# EAGLE design REPORT_flussimetro (EAGLE 9.6.2)
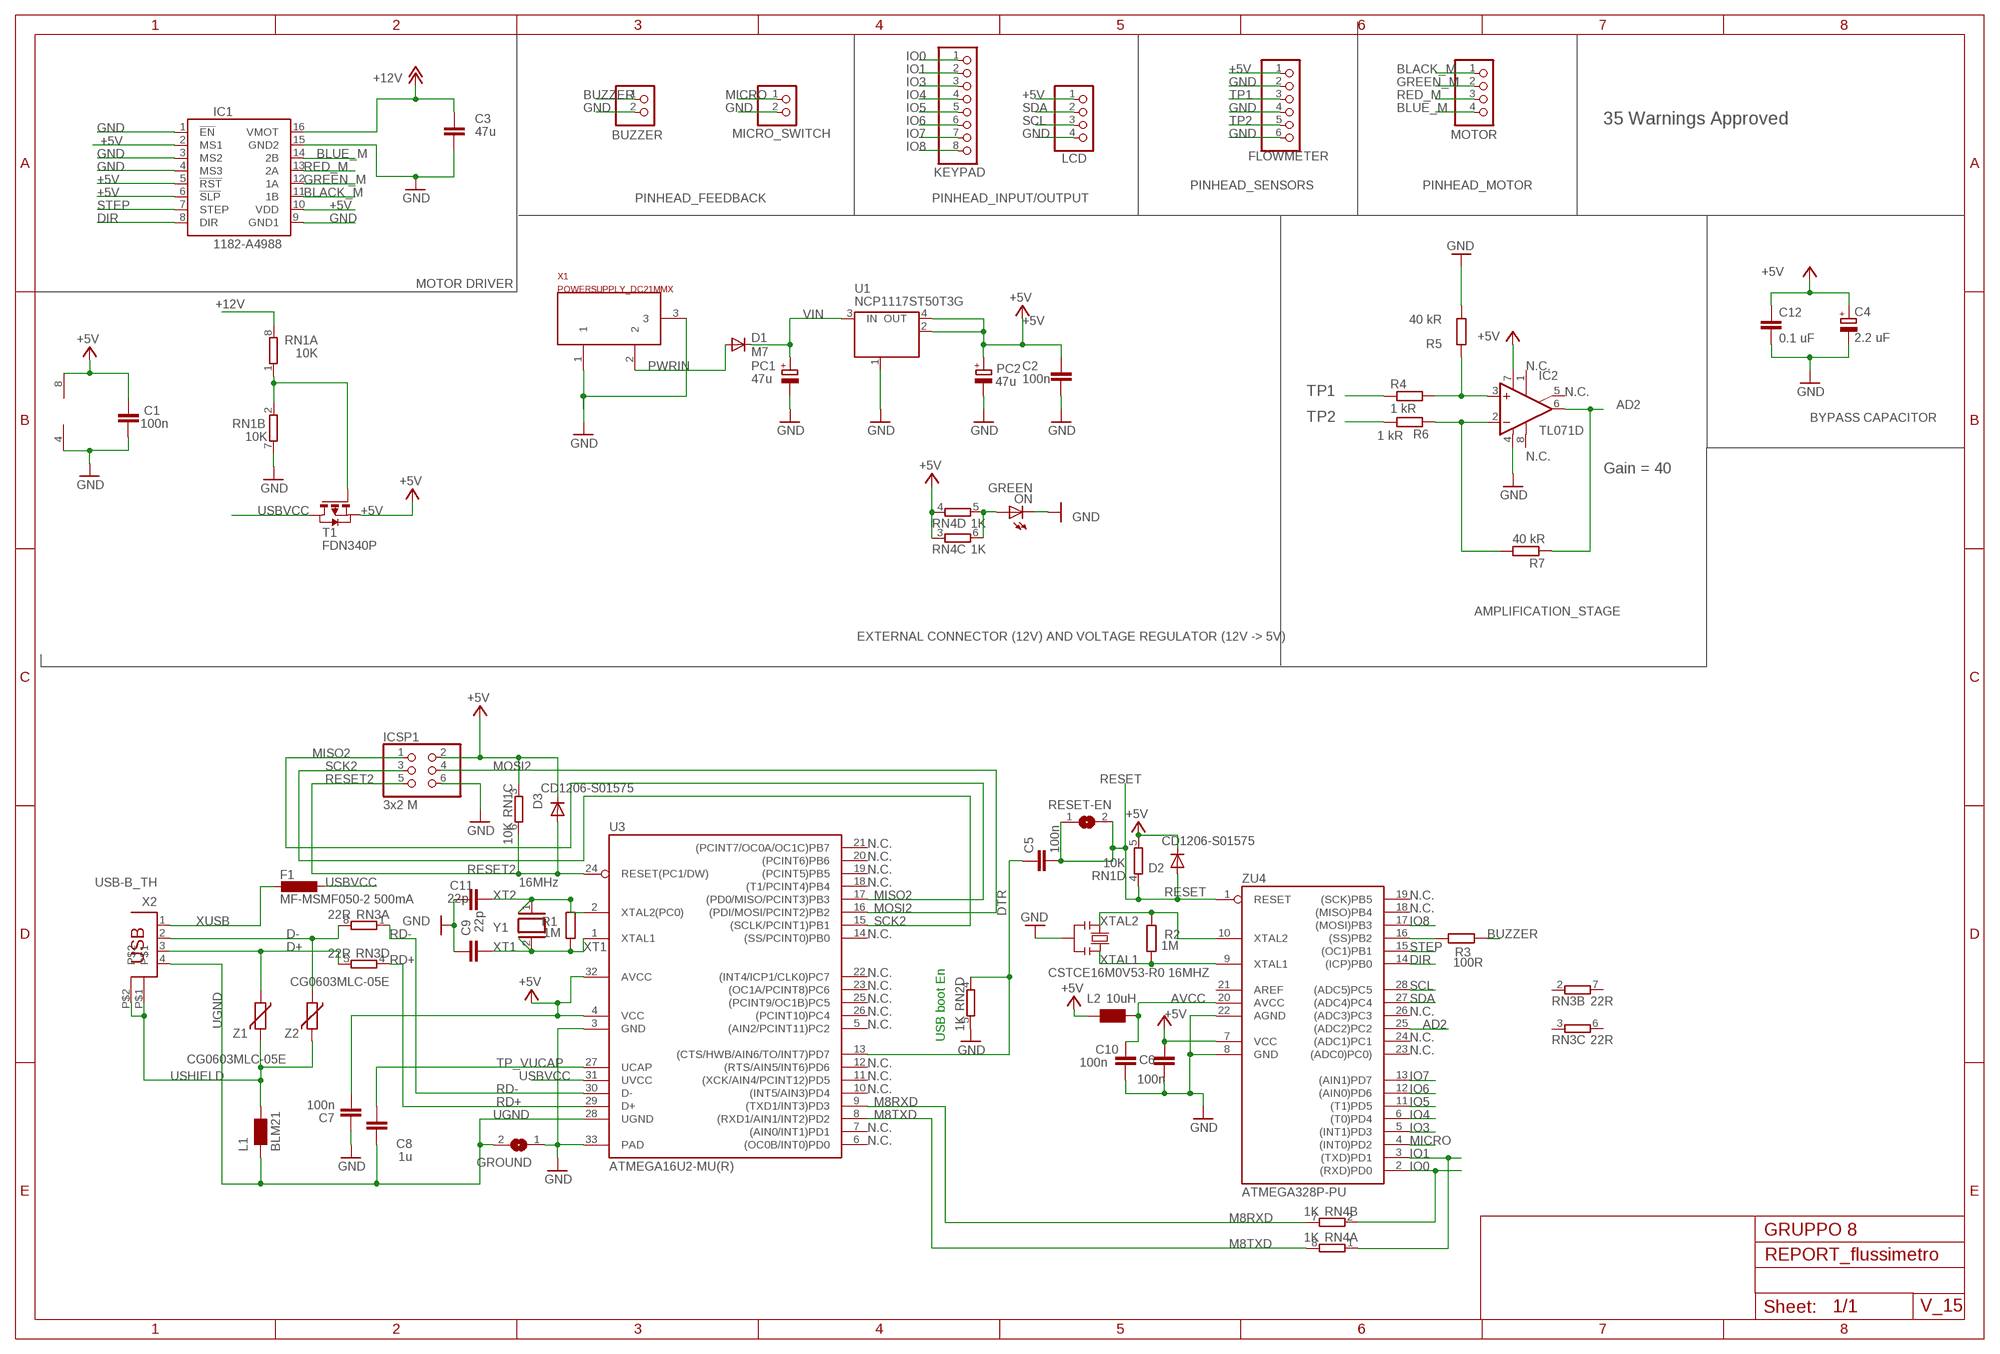
[diagram p0: schematic, sheet 1]

## Parts
BUZZER  PINHD-1X2  [1X02]
C1  100n  C-EU0603-RND  [C0603-ROUND]
C2  100n  C-EU0603-RND  [C0603-ROUND]
C3  47u  C-EUC0603  [C0603]
C4  2.2 uF  CPOL-EUA/3216-18R  [A/3216-18R]
C5  100n  C-EU0603-RND  [C0603-ROUND]
C6  100n  C-EU0603-RND  [C0603-ROUND]
C7  100n  C-EU0603-RND  [C0603-ROUND]
C8  1u  C-EU0603-RND  [C0603-ROUND]
C9  22p  C-EU0603-RND  [C0603-ROUND]
C10  100n  C-EU0603-RND  [C0603-ROUND]
C11  22p  C-EU0603-RND  [C0603-ROUND]
C12  0.1 uF  C-EUC0603  [C0603]
D1  M7  DIODE-SMB  [SMB]
D2  CD1206-S01575  DIODE-MINIMELF  [MINIMELF]
D3  CD1206-S01575  DIODE-MINIMELF  [MINIMELF]
F1  MF-MSMF050-2 500mA  L-EUL1812  [L1812]
FLOWMETER  PINHD-1X6  [1X06]
GROUND  SJ  [SJ]
IC1  1182-A4988  [A4988]
IC2  TL071D  [SO08]
ICSP1  3x2 M  PINHD-2X3  [2X03]
KEYPAD  PINHD-1X8  [1X08]
L1  BLM21  WE-CBF_0805  [0805]
L2  10uH  0715_CV201210-100K  [0805]
LCD  PINHD-1X4  [1X04]
MICRO_SWITCH  PINHD-1X2  [1X02]
MOTOR  PINHD-1X4  [1X04]
ON  GREEN  LEDCHIP-LED0805  [CHIP-LED0805]
PC1  47u  CPOL-EUD  [PANASONIC_D]
PC2  47u  CPOL-EUD  [PANASONIC_D]
R1  1M  R-EU_R0603  [R0603-ROUND]
R2  1M  R-EU_R0603  [R0603-ROUND]
R3  100R  R-EU_R0603  [R0603]
R4  1 kR  R-EU_R0603  [R0603]
R5  40 kR  R-EU_R0603  [R0603]
R6  1 kR  R-EU_R0603  [R0603]
R7  40 kR  R-EU_R0603  [R0603]
RESET-EN  SJ  [SJ]
RN1  10K  4R-NCAY16  [CAY16]
RN2  1K  4R-NCAY16  [CAY16]
RN3  22R  4R-NCAY16  [CAY16]
RN4  1K  4R-NCAY16  [CAY16]
T1  FDN340P  PMOSSOT23  [SOT-23]
U1  NCP1117ST50T3G  MC33269ST-3.3T3  [SOT223]
U3  ATMEGA16U2-MU(R)  ATMEGA16U2-MU  [MLF32]
U5  LMV358IDGKR  LMV358MMX  [MSOP08]
X1  POWERSUPPLY_DC21MMX  [POWERSUPPLY_DC-21MM]
X2  USB-B_TH  PN61729  [PN61729]
Y1  16MHz  XTAL/S  [QS]
Y2  CSTCE16M0V53-R0 16MHZ  RESONATORMU  [RESONATOR]
Z1  CG0603MLC-05E  VARISTORCN0603  [CT/CN0603]
Z2  CG0603MLC-05E  VARISTORCN0603  [CT/CN0603]
ZU4  ATMEGA328P-PU  [DIL28-3]

## Nets
+5V [usbvcc]: C1.2 C2.2 C4.+ C6.2 C7.1 C12.1 D2.C D3.C FLOWMETER.1 IC1.2(MS1) IC1.5(!RST) IC1.6(!SLP) IC1.10(VDD) IC2.7(V+) ICSP1.2 L2.1 LCD.1 PC2.+ RN1.1 RN1.2 RN1.3 RN1.5 RN4.3 RN4.4 T1.2(S) T1.3(G) U1.2(OUT) U1.4(OUT) U3.4(VCC) U3.32(AVCC) U5.8(P:V+) ZU4.7(VCC)
+12V: C3.1 IC1.16(VMOT) RN1.8
AD2: IC2.6(OUT) R7.1 ZU4.25((ADC2)PC2)
AVCC: C10.2 L2.2 ZU4.20(AVCC)
BLACK_M: IC1.11(1B) MOTOR.1
BLUE_M: IC1.14(2B) MOTOR.4
BUZZER: BUZZER.1 R3.2
D+: RN3.5 X2.3 Z1.1
D-: RN3.8 X2.2 Z2.1
DIR: IC1.8(DIR) ZU4.14((ICP)PB0)
DTR: C5.1 RN2.4 U3.13((CTS/HWB/AIN6/TO/INT7)PD7)
GND [gnd]: BUZZER.2 C1.1 C2.1 C3.2 C4.- C6.1 C7.2 C9.2 C10.1 C11.2 C12.2 FLOWMETER.2 FLOWMETER.4 FLOWMETER.6 GROUND.1 IC1.1(!EN) IC1.3(MS2) IC1.4(MS3) IC1.9(GND1) IC1.15(GND2) IC2.4(V-) ICSP1.6 LCD.4 MICRO_SWITCH.2 ON.C PC1.- PC2.- R5.2 RN1.7 RN2.5 U1.1(GND/ADJ) U3.3(GND) U3.33(PAD) U5.4(P:V-) X1.1 X1.3 Y2.2 ZU4.8(GND) ZU4.22(AGND)
GREEN_M: IC1.12(1A) MOTOR.2
IO0: KEYPAD.1 RN4.2 ZU4.2((RXD)PD0)
IO1: KEYPAD.2 RN4.1 ZU4.3((TXD)PD1)
IO3: KEYPAD.3 ZU4.5((INT1)PD3)
IO4: KEYPAD.4 ZU4.6((T0)PD4)
IO5: KEYPAD.5 ZU4.11((T1)PD5)
IO6: KEYPAD.6 ZU4.12((AIN0)PD6)
IO7: KEYPAD.7 ZU4.13((AIN1)PD7)
IO8: KEYPAD.8 ZU4.17((MOSI)PB3)
IO16: R3.1 ZU4.16((SS)PB2)
M8RXD: RN4.7 U3.9((TXD1/INT3)PD3)
M8TXD: RN4.8 U3.8((RXD1/AIN1/INT2)PD2)
MICRO: MICRO_SWITCH.1 ZU4.4((INT0)PD2)
MISO2: ICSP1.1 U3.17((PD0/MISO/PCINT3)PB3)
MOSI2: ICSP1.4 U3.16((PDI/MOSI/PCINT2)PB2)
N$1: IC2.2(-IN) R6.1 R7.2
N$2: IC2.3(+IN) R4.2 R5.1
N$3: ON.A RN4.5 RN4.6
PWRIN [power]: D1.A X1.2
RD+: RN3.4 U3.29(D+)
RD-: RN3.1 U3.30(D-)
RED_M: IC1.13(2A) MOTOR.3
RESET: C5.2 D2.A RESET-EN.1 RESET-EN.2 RN1.4 ZU4.1(RESET)
RESET2: D3.A ICSP1.5 RN1.6 U3.24(RESET(PC1/DW))
SCK2: ICSP1.3 U3.15((SCLK/PCINT1)PB1)
SCL: LCD.3 ZU4.28((ADC5)PC5)
SDA: LCD.2 ZU4.27((ADC4)PC4)
STEP: IC1.7(STEP) ZU4.15((OC1)PB1)
TP1: FLOWMETER.3 R4.1
TP2: FLOWMETER.5 R6.2
TP_VUCAP: C8.1 U3.27(UCAP)
UGND [gnd]: C8.2 GROUND.2 L1.1 U3.28(UGND) X2.4
USBVCC [usbvcc]: F1.1 T1.1(D) U3.31(UVCC)
USHIELD [gnd]: L1.2 X2.P$1 X2.P$2 Z1.2 Z2.2
VIN [power]: D1.C PC1.+ U1.3(IN)
XT1: C9.1 R1.1 U3.1(XTAL1) Y1.2
XT2: C11.1 R1.2 U3.2(XTAL2(PC0)) Y1.1
XTAL1: R2.1 Y2.3 ZU4.9(XTAL1)
XTAL2: R2.2 Y2.1 ZU4.10(XTAL2)
XUSB [usbvcc]: F1.2 X2.1
Unconnected: IC2.1(ON1) IC2.5(ON2) IC2.8(OPT) RN2.1 RN2.2 RN2.3 RN2.6 RN2.7 RN2.8 RN3.2 RN3.3 RN3.6 RN3.7 U3.5((AIN2/PCINT11)PC2) U3.6((OC0B/INT0)PD0) U3.7((AIN0/INT1)PD1) U3.10((INT5/AIN3)PD4) U3.11((XCK/AIN4/PCINT12)PD5) U3.12((RTS/AIN5/INT6)PD6) U3.14((SS/PCINT0)PB0) U3.18((T1/PCINT4)PB4) U3.19((PCINT5)PB5) U3.20((PCINT6)PB6) U3.21((PCINT7/OC0A/OC1C)PB7) U3.22((INT4/ICP1/CLK0)PC7) U3.23((OC1A/PCINT8)PC6) U3.25((PCINT9/OC1B)PC5) U3.26((PCINT10)PC4) U5.1(A:OUT) U5.2(A:-IN) U5.3(A:+IN) U5.5(B:+IN) U5.6(B:-IN) U5.7(B:OUT) ZU4.18((MISO)PB4) ZU4.19((SCK)PB5) ZU4.21(AREF) ZU4.23((ADC0)PC0)) ZU4.24((ADC1)PC1) ZU4.26((ADC3)PC3)

## Notes on the sheet
- 35 Warnings Approved
- PINHEAD_SENSORS | PINHEAD_MOTOR
- PINHEAD_FEEDBACK | PINHEAD_INPUT/OUTPUT
- MOTOR DRIVER
- N.C.
- N.C.
- BYPASS CAPACITOR
- N.C.
- Gain = 40
- AMPLIFICATION_STAGE
- EXTERNAL CONNECTOR (12V) AND VOLTAGE REGULATOR (12V -> 5V)
- N.C.
- N.C.
- N.C.
- N.C.
- N.C.
- N.C.
- N.C.
- N.C.
- N.C.
- N.C.
- N.C. | N.C.
- N.C.
- USB boot En | N.C.
- N.C.
- N.C.
- N.C.
- N.C.
- N.C.
- N.C.
- GRUPPO 8
- V_15

## Library data of the parts
BUZZER MICRO_SWITCH = pinhead:PINHD-1X2: PIN HEADER; MF: AMP - TE CONNECTIVITY; MPN: 826926-2; OC_FARNELL: 1248140
C1 C2 C5-C7 C10 = SmartPrj:C-EU: CAPACITOR, European symbol; MF: GEDORE; MPN: 4550-10; OC_FARNELL: 4726741
C3 = rcl:C-EU: CAPACITOR, European symbol; MF: MURATA; MPN: GRM188R60J476ME15D; OC_FARNELL: 3582851; SPICEPREFIX: C
C4 = rcl:CPOL-EU: POLARIZED CAPACITOR, European symbol; MF: KYOCERA AVX; MPN: TAJA225K016RNJ; OC_FARNELL: 197233; SPICEPREFIX: C
C8 = SmartPrj:C-EU: CAPACITOR, European symbol; MF: TDK; MPN: C1608X5R1C105K080AA; OC_FARNELL: 2211167
C9 C11 = SmartPrj:C-EU: CAPACITOR, European symbol; MF: KYOCERA AVX; MPN: 06035A220FAT2A; OC_FARNELL: 2332610
C12 = rcl:C-EU: CAPACITOR, European symbol; MF: KYOCERA AVX; MPN: 0603YC104KAT2A; OC_FARNELL: 1327679; SPICEPREFIX: C
D1 = diode:DIODE-: DIODE; MF: DIODES INC.; MPN: S1M-13-F; OC_FARNELL: 1773482
D2 D3 = diode:DIODE-: DIODE; MF: BOURNS; MPN: CD1206-S01575; OC_FARNELL: 2211947
F1 = rcl:L-EU: INDUCTOR, European symbol; MF: BOURNS; MPN: MF-MSMF050-2; OC_FARNELL: 9350314
FLOWMETER = pinhead:PINHD-1X6: PIN HEADER; MF: MULTICOMP PRO; MPN: 2211S-06G; OC_FARNELL: 1593415
GROUND RESET-EN = jumper:SJ: SMD solder JUMPER; OC_FARNELL: unknown
IC1 = DRIVER MOTORE:1182-A4988: A4988 Stepper Motor Driver Carrier #1182 A4988 Stepper Motor Driver Carrier <https://www.pololu.com/product/1182> in Japan, Suzaku Lab. Ltd. <https://suzakugiken.jp/> #1182 A4988ステッピングモータドライバ <https://szc.jp/po1182>; OC_FARNELL: unknown
IC2 = linear:TL071: OP AMP; MF: ANALOG DEVICES; MPN: LT1211CS8#TRPBF; OC_FARNELL: 4020590
ICSP1 = SmartPrj:PINHD-2X3: PIN HEADER; MF: MOLEX; MPN: 87758-0616; OC_FARNELL: 7472323
KEYPAD = pinhead:PINHD-1X8: PIN HEADER; MF: MULTICOMP PRO; MPN: 2211S-08G; OC_FARNELL: 1593416
L1 = wuerth-elektronik:WE-CBF: SMD EMI Suppression Ferrite Beads - excellent anti-EMI properties - low DCR - impedances till 3000 ohms - rated current up to 6 A; MF: MURATA; MPN: BLM21SP471BH1D; OC_FARNELL: 3227834
L2 = Induttanze:0715_CV201210-100K: 10uH 0805; CASE: 0805; MF: BOURNS; MONTHLY_USAGE: _____; MPN: CV201210-100K; OC_FARNELL: 2333632; PART_NUMBER: CV201210-100K; PRICE: _____; SUPPLIER: _____; TYPE: Induttanze
LCD MOTOR = pinhead:PINHD-1X4: PIN HEADER; MF: AMP - TE CONNECTIVITY; MPN: 826926-4; OC_FARNELL: 1248142
ON = led:LED: LED OSRAM: - CHIPLED LG R971, LG N971, LY N971, LG Q971, LY Q971, LO R971, LY R971 LH N974, LH R974 LS Q976, LO Q976, LY Q976 LO Q996 - Hyper CHIPLED LW Q18S LB Q993, LB Q99A, LB R99A - SideLED LS A670, LO A670, LY A670, LG A670, LP A670 LB A673, LV A673, LT A673, LW A673 LH A674 LY A675 LS A676, LA A676, LO A676, LY A676, LW A676 LS A679, LY A679, LG A679 - Hyper Micro SIDELED® LS Y876, LA Y876, LO Y876, LY Y876 LT Y87S - SmartLED LW L88C, LW L88S LB L89C, LB L89S, LG L890 LS L89K, LO L89K, LY L89K LS L896, LA L896, LO L896, LY L896 - TOPLED LS T670, LO T670, LY T670, LG T670, LP T670 LSG T670, LSP T670, LSY T670, LOP T670, LYG T670 LG T671, LOG T671, LSG T671 LB T673, LV T673, LT T673, LW T673 LH T674 LS T676, LA T676, LO T676, LY T676, LB T676, LH T676, LSB T676, LW T676 LB T67C, LV T67C, LT T67C, LS T67K, LO T67K, LY T67K, LW E67C LS E67B, LA E67B, LO E67B, LY E67B, LB E67C, LV E67C, LT E67C LW T67C LS T679, LY T679, LG T679 LS T770, LO T770, LY T770, LG T770, LP T770 LB T773, LV T773, LT T773, LW T773 LH T774 LS E675, LA E675, LY E675, LS T675 LS T776, LA T776, LO T776, LY T776, LB T776 LHGB T686 LT T68C, LB T68C - Hyper Mini TOPLED® LB M676 - Mini TOPLED Santana® LG M470 LS M47K, LO M47K, LY M47K Source: http://www.osram.convergy.de LUXEON: - LUMILED® LXK2-PW12-R00, LXK2-PW12-S00, LXK2-PW14-U00, LXK2-PW14-V00 LXK2-PM12-R00, LXK2-PM12-S00, LXK2-PM14-U00 LXK2-PE12-Q00, LXK2-PE12-R00, LXK2-PE12-S00, LXK2-PE14-T00, LXK2-PE14-U00 LXK2-PB12-K00, LXK2-PB12-L00, LXK2-PB12-M00, LXK2-PB14-N00, LXK2-PB14-P00, LXK2-PB14-Q00 LXK2-PR12-L00, LXK2-PR12-M00, LXK2-PR14-Q00, LXK2-PR14-R00 LXK2-PD12-Q00, LXK2-PD12-R00, LXK2-PD12-S00 LXK2-PH12-R00, LXK2-PH12-S00 LXK2-PL12-P00, LXK2-PL12-Q00, LXK2-PL12-R00 Source: www.luxeon.com KINGBRIGHT: KA-3528ASYC Source: www.kingbright.com; MF: KINGBRIGHT; MPN: KP-1608SGC; OC_FARNELL: 8529833
PC1 PC2 = rcl:CPOL-EU: POLARIZED CAPACITOR, European symbol; MF: PANASONIC; MPN: EEE1EA470WP; OC_FARNELL: 2805691
R1 R2 = SmartPrj:R-EU_: RESISTOR, European symbol; MF: TE CONNECTIVITY; MPN: CRGH0603J1M0; OC_FARNELL: 2331766
R3 = rcl:R-EU_: RESISTOR, European symbol; MF: PANASONIC; MPN: ERJPA3F1000V; OC_FARNELL: 2335829; SPICEPREFIX: R
R4 R6 = rcl:R-EU_: RESISTOR, European symbol; MF: NEOHM - TE CONNECTIVITY; MPN: CPF0603B1K0E1; OC_FARNELL: 1697375; SPICEPREFIX: R
R5 R7 = rcl:R-EU_: RESISTOR, European symbol; MF: YAGEO; MPN: AT0603BRD0740KL; OC_FARNELL: 3952492; SPICEPREFIX: R
RN1 = resistor-dil:4R-N: Array Chip Resistor Source: RS Component / Phycomp; MF: BOURNS; MPN: CAY16-1002F4LF; OC_FARNELL: 1770143
RN2 RN4 = resistor-dil:4R-N: Array Chip Resistor Source: RS Component / Phycomp; MF: BOURNS; MPN: CAY16-102J4LF; OC_FARNELL: 1770133
RN3 = resistor-dil:4R-N: Array Chip Resistor Source: RS Component / Phycomp; MF: BOURNS; MPN: CAY16-220J4LF; OC_FARNELL: 1770127
T1 = zetex:PMOSSOT23: MOS FET; MF: ONSEMI; MPN: FDN340P; OC_FARNELL: 9846310
U1 = linear:MC33269ST*: Adjustable Output Low Dropout Voltage Regulator 800 mA Source: http://www.onsemi.com/pub/Collateral/MC33269-D.PDF; MF: ONSEMI; MPN: NCP1117ST50T3G; OC_FARNELL: 2112617
U3 = SmartPrj:ATMEGA16U2-; MF: MICROCHIP; MPN: ATMEGA16U2-MUR; OC_FARNELL: 2695247
U5 = linear:LMV358?*: Dual General Purpose, Low Voltage, Rail-to-Rail Output Operational Amplifiers Source: http://www.national.com/mpf/LM/LMV321.html http://www.national.com/dt/lmv_qual.pdf; MF: STMICROELECTRONICS; MPN: LMV358LIST; OC_FARNELL: 2849869
X1 = SmartPrj:POWERSUPPLY_DC21MM; MF: LUMBERG; MPN: 1613 21; OC_FARNELL: 3583208
X2 = SmartPrj:PN61729: BERG USB connector; MF: MULTICOMP PRO; MPN: SPC4937; OC_FARNELL: 3699894
Y1 = SmartPrj:XTAL/S: CRYSTAL; MF: ECS INC INTERNATIONAL; MPN: ECS-160-20-4X; OC_FARNELL: 4059213RL
Y2 = SmartPrj:RESONATOR; MF: MURATA; MPN: CSTNE16M0V51C000R0; OC_FARNELL: 4129976
Z1 Z2 = varistor:VARISTOR: VARISTOR; MF: BOURNS; MPN: CG0603MLC-05E; OC_FARNELL: 1838966
ZU4 = SmartPrj:ATMEGA328P-: MICROCONTROLLER 4 Kbytes FLASH 128 bytes SRAM 256 bytes EEPROM UART 6-channel 10 bit ADC; MF: MICROCHIP; MPN: ATMEGA328P-PU; OC_FARNELL: 1715487

## Net classes
0 default: width 0.254 mm, clearance 0.254 mm
1 power: width 0.61 mm, drill 0.61 mm, clearance 0.254 mm
2 gnd: width 0.305 mm, drill 0.559 mm, clearance 0.254 mm
3 usbvcc: width 0.508 mm, drill 0.61 mm, clearance 0.254 mm
4 aref: width 0.406 mm, drill 0.61 mm, clearance 0.254 mm

## Board
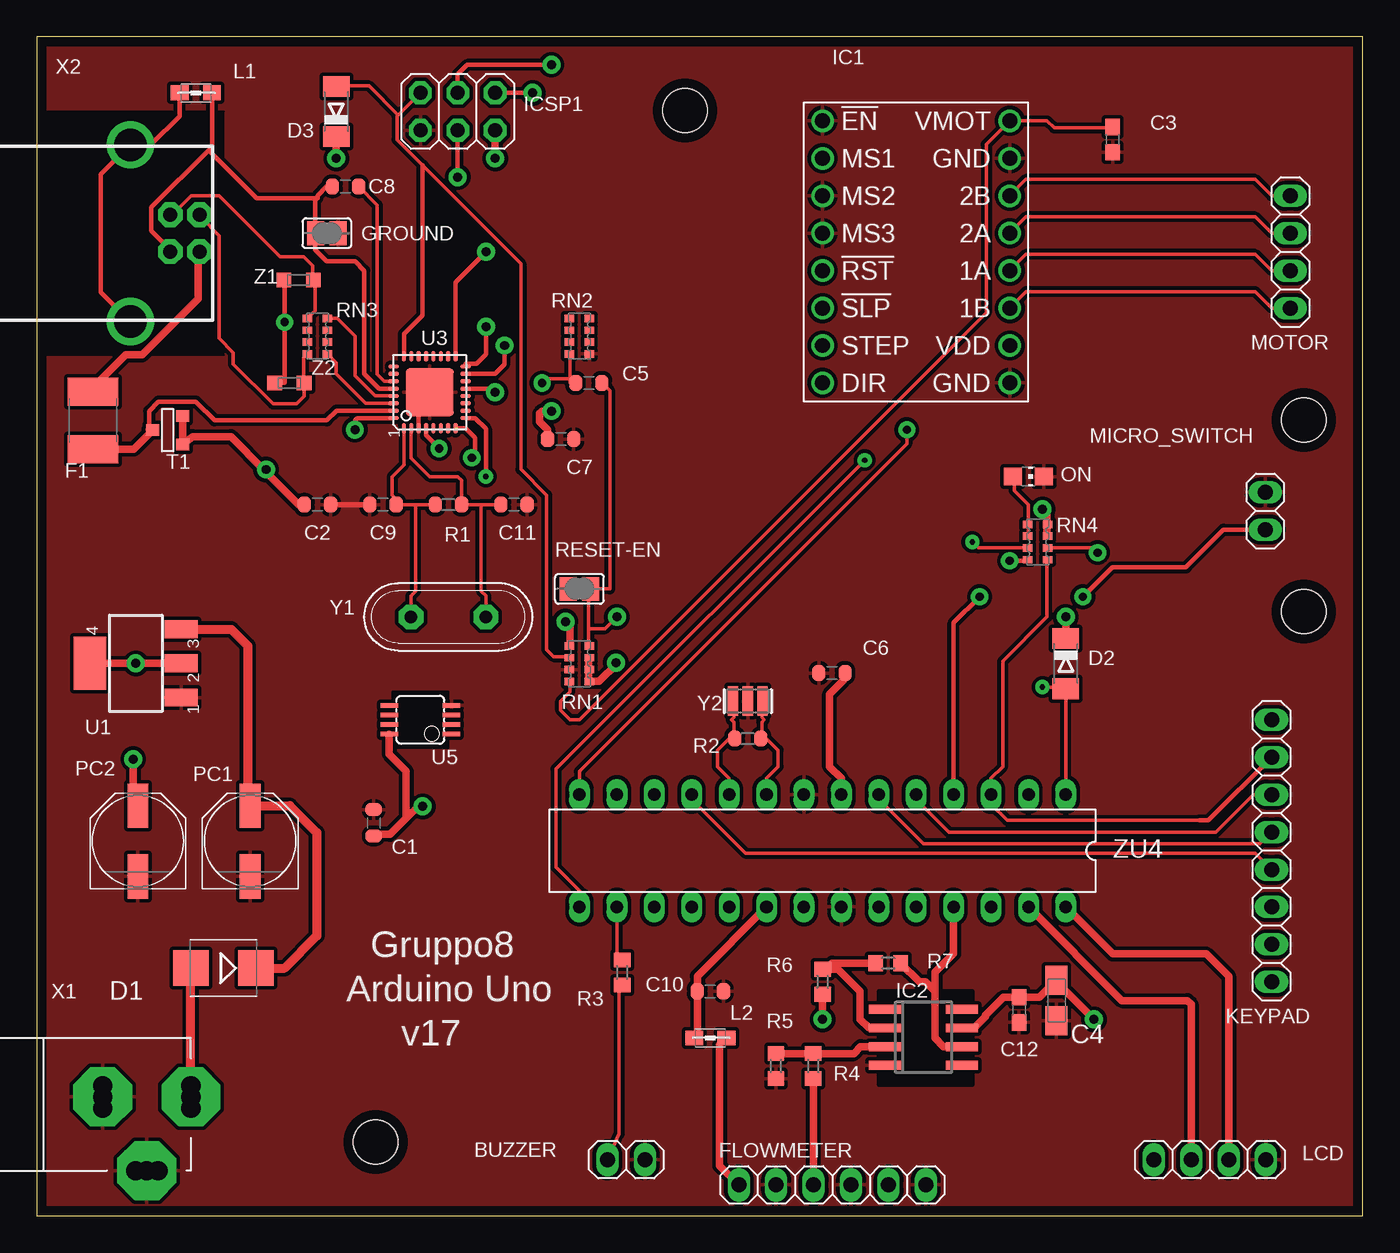
[diagram p1: board, top side]
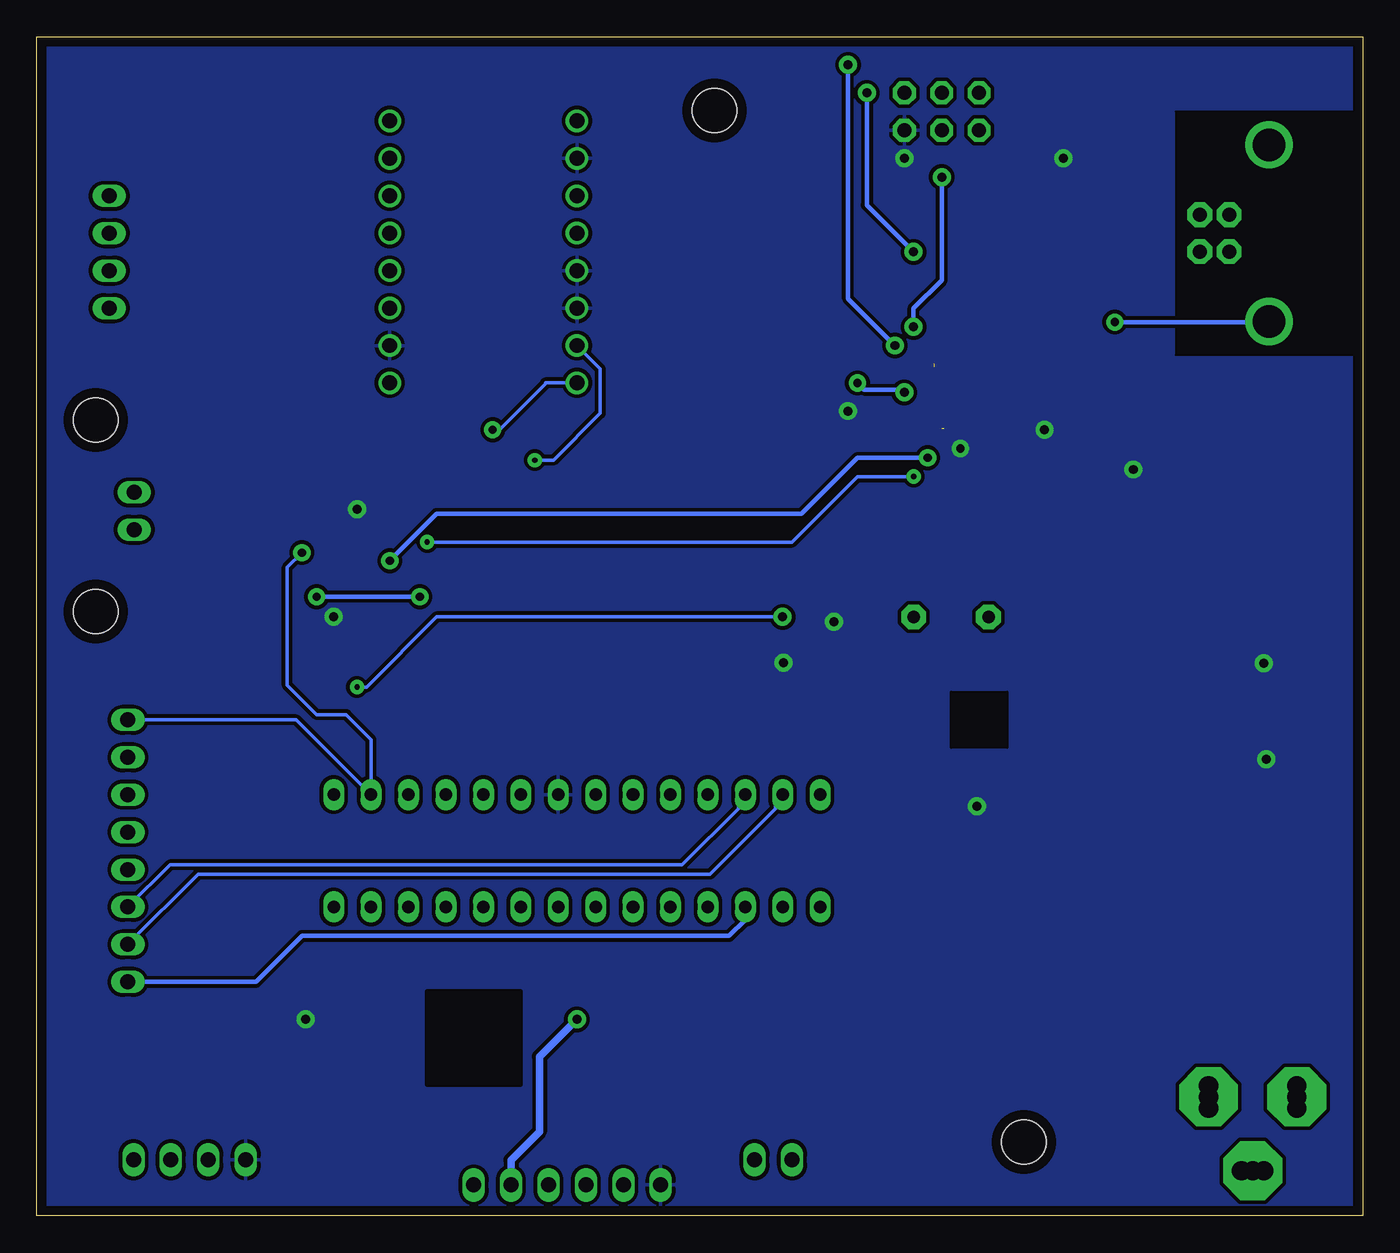
[diagram p2: board, bottom side, seen from below]

Size 90 x 80 mm. Coordinates in mm from the lower left corner, seen from the top.
Outline: 0,80 0,0 90,0 90,80 0,80
Copper layers (1*16): Top 0.035mm / dielectric 1.5mm / Bottom 0.035mm
Design rules "default *": minimum track width 10mil, minimum drill 22mil, track to track 10mil, track to pad 10mil, pad to pad 10mil, via to via 12mil, smd to smd 8mil, copper to edge 26mil, drill to drill 12mil, minimum pad ring 10mil, minimum via ring 12mil, stop-mask expansion 1mil, vias tented up to drill 30mil, thermal gap 10mil
Holes 3 mm at 23,5 44,75 86,54 86,41

### Footprints (pad centres in the part's own frame; a part is rotated, then mirrored left to right if it is on the bottom)
1X02 = drill 1.016 long: 1 -1.27,0; 2 1.27,0
C0603-ROUND = smd 0.898 x 1.1: 1 -0.889,0; 2 0.889,0
C0603 = smd 1.1 x 1: 1 -0.85,0; 2 0.85,0
A/3216-18R = smd 1.95 x 1.5: + 1.375,0; - -1.375,0
SMB = smd 2.4 x 2.4: A 2.2,0; C -2.2,0
MINIMELF = smd 1.4 x 1.8: A 1.7,0; C -1.7,0
L1812 = smd 1.9 x 3.4: 1 -1.95,0; 2 1.95,0
1X06 = drill 1.016 long: 1 -6.35,0; 2 -3.81,0; 3 -1.27,0; 4 1.27,0; 5 3.81,0; 6 6.35,0
SJ = smd 1.168 x 1.6: 1 -0.762,0; 2 0.762,0
A4988 = drill 1.016: 1 -6.35,8.89; 2 -6.35,6.35; 3 -6.35,3.81; 4 -6.35,1.27; 5 -6.35,-1.27; 6 -6.35,-3.81; 7 -6.35,-6.35; 8 -6.35,-8.89; 9 6.35,-8.89; 10 6.35,-6.35; 11 6.35,-3.81; 12 6.35,-1.27; 13 6.35,1.27; 14 6.35,3.81; 15 6.35,6.35; 16 6.35,8.89
SO08 = smd 0.6 x 2.2: 1 -1.905,-2.6; 2 -0.635,-2.6; 3 0.635,-2.6; 4 1.905,-2.6; 5 1.905,2.6; 6 0.635,2.6; 7 -0.635,2.6; 8 -1.905,2.6
2X03 = drill 0.95 pad 1.55 octagon: 1 -2.54,-1.27; 2 -2.54,1.27; 3 0,-1.27; 4 0,1.27; 5 2.54,-1.27; 6 2.54,1.27
1X08 = drill 1.016 long: 1 -8.89,0; 2 -6.35,0; 3 -3.81,0; 4 -1.27,0; 5 1.27,0; 6 3.81,0; 7 6.35,0; 8 8.89,0
0805 = smd 1.2 x 1: 1 -1.1,0; 2 1.1,0
1X04 = drill 1.016 long: 1 -3.81,0; 2 -1.27,0; 3 1.27,0; 4 3.81,0
CHIP-LED0805 = smd 1.2 x 1.2: A 0,-1.05; C 0,1.05
PANASONIC_D = smd 3 x 1.4: + 2.4,0; - -2.4,0
R0603-ROUND = smd 0.898 x 1.1: 1 -0.889,0; 2 0.889,0
R0603 = smd 1 x 1.1: 1 -0.85,0; 2 0.85,0
CAY16 = smd 0.5 x 0.65: 1 -1.2,-0.675; 2 -0.4,-0.675; 3 0.4,-0.675; 4 1.2,-0.675; 5 1.2,0.675; 6 0.4,0.675; 7 -0.4,0.675; 8 -1.2,0.675
SOT-23 = smd 0.787 x 0.889: 1 0.025,-1.016; 2 -0.94,1.016; 3 0.991,1.016
SOT223 = smd 1.219 x 2.235: 1 -2.311,-3.099; 2 0,-3.099; 3 2.311,-3.099 | smd 3.6 x 2.2: 4 0,3.099
MLF32 = smd 0.7 x 0.28: 1 -2.45,1.75; 2 -2.45,1.25; 3 -2.45,0.75; 4 -2.45,0.25; 5 -2.45,-0.25; 6 -2.45,-0.75; 7 -2.45,-1.25; 8 -2.45,-1.75; 17 2.45,-1.75; 18 2.45,-1.25; 19 2.45,-0.75; 20 2.45,-0.25; 21 2.45,0.25; 22 2.45,0.75; 23 2.45,1.25; 24 2.45,1.75 | smd 0.28 x 0.7: 9 -1.75,-2.45; 10 -1.25,-2.45; 11 -0.75,-2.45; 12 -0.25,-2.45; 13 0.25,-2.45; 14 0.75,-2.45; 15 1.25,-2.45; 16 1.75,-2.45; 25 1.75,2.45; 26 1.25,2.45; 27 0.75,2.45; 28 0.25,2.45; 29 -0.25,2.45; 30 -0.75,2.45; 31 -1.25,2.45; 32 -1.75,2.45 | smd 3.254 x 3.254: 33 0,0
MSOP08 = smd 0.3 x 1.2: 1 -0.976,-2.113; 2 -0.326,-2.113; 3 0.324,-2.113; 4 0.974,-2.113; 5 0.974,2.112; 6 0.324,2.112; 7 -0.326,2.112; 8 -0.976,2.112
POWERSUPPLY_DC-21MM = drill 1.3 pad 4 octagon: 1 -5.08,-3.353; 2 -0.076,-6.35; 3 -0.076,-0.356 | drill 1.3: 4 -5.08,-4.115; 5 -5.08,-2.591; 6 -0.838,-0.356; 7 0.686,-0.356; 8 -0.838,-6.35; 9 0.686,-6.35
PN61729 = drill 0.95 pad 1.676 octagon: 1 1.25,4.71; 2 -1.25,4.71; 3 -1.25,2.71; 4 1.25,2.71 | drill 2.2: P$1 -6,0; P$2 6,0
QS = drill 0.85 pad 1.676 octagon: 1 -2.54,0; 2 2.54,0
RESONATOR = smd 0.7 x 2: 1 -1,0; 2 0,0; 3 1,0
CT/CN0603 = smd 1 x 1: 1 -1,0; 2 1,0
DIL28-3 = drill 0.85 pad 1.422 long: 1 -16.51,-3.81; 2 -13.97,-3.81; 3 -11.43,-3.81; 4 -8.89,-3.81; 5 -6.35,-3.81; 6 -3.81,-3.81; 7 -1.27,-3.81; 8 1.27,-3.81; 9 3.81,-3.81; 10 6.35,-3.81; 11 8.89,-3.81; 12 11.43,-3.81; 13 13.97,-3.81; 14 16.51,-3.81; 15 16.51,3.81; 16 13.97,3.81; 17 11.43,3.81; 18 8.89,3.81; 19 6.35,3.81; 20 3.81,3.81; 21 1.27,3.81; 22 -1.27,3.81; 23 -3.81,3.81; 24 -6.35,3.81; 25 -8.89,3.81; 26 -11.43,3.81; 27 -13.97,3.81; 28 -16.51,3.81

### Placement (x,y rotation side)
BUZZER  40.01,3.81 0 top
C1  22.86,26.67 270 top
C2  19.05,48.26 180 top
C3  73.03,73.03 270 top
C4  69.22,14.61 90 top
C5  37.47,56.52 0 top
C6  53.98,36.83 0 top
C7  35.56,52.7 0 top
C8  20.95,69.85 180 top
C9  23.5,48.26 180 top
C10  45.72,15.24 180 top
C11  32.38,48.26 0 top
C12  66.67,13.97 270 top
D1  12.67,16.81 180 top
D2  69.85,37.47 270 top
D3  20.32,74.93 90 top
F1  3.81,53.98 90 top
FLOWMETER  54,2.1 0 top
GROUND  19.68,66.67 180 top
IC1  59.69,65.41 0 top
IC2  60.2,12.11 270 top
ICSP1  28.57,74.93 180 top
KEYPAD  83.82,24.77 270 top
L1  10.79,76.2 180 top
L2  45.72,12.06 180 top
LCD  79.63,3.81 0 top
MICRO_SWITCH  83.39,47.83 90 top
MOTOR  85.09,65.41 90 top
ON  67.31,50.16 270 top
PC1  14.48,25.43 90 top
PC2  6.86,25.43 90 top
R1  27.94,48.26 0 top
R2  48.26,32.38 180 top
R3  39.73,16.51 270 top
R4  52.7,10.16 90 top
R5  50.16,10.16 270 top
R6  53.34,15.88 270 top
R7  57.78,17.14 180 top
RESET-EN  36.83,42.55 0 top
RN1  36.83,37.47 90 top
RN2  36.83,59.69 270 top
RN3  19.05,59.69 90 top
RN4  67.94,45.72 90 top
T1  8.89,53.34 270 top
U1  6.71,37.48 90 top
U3  26.67,55.88 90 top
U5  26.04,33.66 90 top
X1  4.11,8.14 90 top
X2  6.35,66.67 270 top
Y1  27.94,40.64 180 top
Y2  48.26,34.92 0 top
Z1  17.78,63.5 180 top
Z2  17.14,56.52 180 top
ZU4  53.34,24.77 180 top

### Tracks (layer width: path | path; a pad name or v marks a point on that pad's centre or on a via)
+5V  (via drill 0.56, 0.61)
  Top 0.305: U3.4 26.42,52.95 v27.3,52.07 | U3.32 21.75,54.13 21.59,53.98 v21.59,53.34
  Top 0.508: C2.2 17.78,48.26 15.48,50.56 | 15.48,50.56 13.18,52.86 10.57,52.86 T1.3 T1.2 | U1.4 v6.71,37.48 U1.2 | 25.08,26.99 26.04,27.94 v26.19,27.78 | 25.08,26.99 23.97,25.88 22.86,25.88 C1.2 | 25.08,26.99 25.08,30.16 23.92,31.32 U5.8 | RN1.3 37.47,37.78 37.47,37.31 RN1.2 37.47,36.99 37.47,36.35 RN1.1 38.17,36.27 39.37,37.47 v39.3,37.53 | RN4.3 68.58,46.2 68.58,46.83 RN4.4 68.58,47.15 68.58,47.62 v68.26,47.94 | v35.88,40.32 36.2,40.01 36.2,38.73 RN1.5 | v34.92,54.61 34.29,54.61 | 34.29,54.61 | 34.29,54.61 34.13,54.45 34.13,53.88 34.67,53.34 C7.1 | ZU4.7 54.61,29.69 53.82,30.48 53.82,35.4 54.77,36.35 54.77,36.83 C6.2 | v20.32,71.75 D3.C | v69.85,40.64 D2.C | PC2.+ 6.54,28.15 v6.54,30.99 | v15.56,50.64 15.48,50.56 | ICSP1.2 v31.11,71.75 | FLOWMETER.1 46.35,3.39 46.35,11.6 L2.1 | v71.75,13.34 69.22,15.88 C4.+ 68.06,14.82 67.31,14.82 C12.1 65.62,14.82 64.4,13.6 64.4,13.51 63.64,12.74 IC2.7
  pour Bottom: 0,80.01 0,0 90.17,0 90.17,80.01
  cutout Bottom: 0,74.93 12.7,74.93 12.7,58.42 0,58.42
  cutout Bottom: 24.13,35.56 24.13,31.75 27.94,31.75 27.94,35.56
  cutout Bottom: 57.15,15.24 57.15,8.89 63.5,8.89 63.5,15.24
+12V
  Top 0.254: RN1.8 36.2,36.2 36.2,35.56 35.56,34.92 35.56,34.29 36.2,33.66 36.83,33.66 64.45,61.28 64.45,72.71 IC1.16 68.58,74.3 69.06,73.82 73.03,73.82 C3.1
AD2
  Top 0.508: ZU4.25 62.23,17.78 60.96,16.51 60.96,15.24 | IC2.6 61.55,11.47 60.96,12.06 60.96,14.61 60.96,15.24 | R7.1 59.91,15.88 60.33,15.88 60.96,15.24
AVCC
  Top 0.508: ZU4.20 44.83,16.26 C10.2 44.83,12.28 L2.2
BLACK_M
  Top 0.254: IC1.11 67.15,62.71 82.71,62.71 83.82,61.59 MOTOR.1
BLUE_M
  Top 0.254: IC1.14 67.15,70.33 82.71,70.33 83.82,69.22 MOTOR.4
BUZZER
  Top 0.254: R3.2 39.53,15.45 39.53,5.56 BUZZER.1
D+
  Top 0.254: RN3.5 18.89,61.41 18.89,63.5 Z1.1 18.73,63.5 18.73,64.45 18.1,65.09 16.51,65.09 12.38,69.22 10.48,69.22 9.21,67.94 X2.3
D-
  Top 0.254: X2.2 11.11,67.79 12.38,66.52 12.38,59.53 13.34,58.58 13.34,57.78 16.03,55.09 17.62,55.09 18.14,55.61 Z2.1 18.1,56.56 18.1,58.21 RN3.8
DIR  (via drill 0.56)
  Top 0.254: v59.05,53.34 59.05,52.39 36.83,30.16 ZU4.14
  Bottom 0.254: IC1.8 55.47,56.52 55.47,56.45 58.58,53.34 v59.05,53.34
DTR  (via drill 0.56, 0.61)
  Top 0.254: RN2.4 36.2,58.42 36.2,56.52 C5.1 36.3,56.79 34.57,56.79 v34.29,56.52
  Top 0.305: U3.13 30.86,56.13 v31.11,55.88
  Bottom 0.305: v34.29,56.52 33.84,56.07 31.3,56.07 v31.11,55.88
GND
  Top 0.305: U3.3 25.92,55.13 U3.33
  Top 0.381: C9.2 C2.1
  pour Top: 0,80 0,0 90,0 90.17,80.01
  cutout Top: 24.13,35.56 24.13,31.75 27.94,31.75 27.94,35.56
  cutout Top: 0,58.42 12.7,58.42 12.7,74.93 0,74.93
  cutout Top: 57.15,15.24 57.15,8.89 63.5,8.89 63.5,15.24
GREEN_M
  Top 0.254: IC1.12 67.15,65.25 82.71,65.25 83.82,64.14 MOTOR.2
IO0  (via drill 0.56)
  Top 0.254: RN4.2 71.68,45.32 v72,45
  Bottom 0.254: KEYPAD.1 72.39,33.66 ZU4.2 67.31,32.31 69,34 71,34 73,36 73,44 v72,45
IO1
  Top 0.254: RN4.1 68.58,44.45 68.58,40.64 65.56,37.62 65.56,30.48 64.77,29.69 ZU4.3 64.77,27.94 65.88,26.83 78.9,26.83
  Top 0.305: 78.9,26.83 79.53,26.83 KEYPAD.2
IO3
  Top 0.254: ZU4.5 59.69,28.26 61.91,26.04 80.03,26.04 82.58,28.57 KEYPAD.3
IO4
  Top 0.254: ZU4.6 57.15,28.26 60.17,25.24 83.03,25.24 KEYPAD.4
IO5
  Top 0.254: ZU4.11 44.45,28.26 48.1,24.61 82.71,24.61 KEYPAD.5
IO6
  Bottom 0.254: ZU4.12 42.39,28.1 42.39,27.62 46.2,23.81 80.96,23.81 KEYPAD.6
IO7
  Bottom 0.254: ZU4.13 39.85,28.1 39.85,27.62 44.29,23.18 79.06,23.18 KEYPAD.7
IO8
  Bottom 0.305: ZU4.17 41.91,20.09 43,19 72,19 75,16 75.12,15.88 KEYPAD.8
IO16
  Top 0.254: ZU4.16 39.37,17.73 R3.1
M8RXD  (via drill 0.35)
  Top 0.254: RN4.7 63.9,45.32 v63.5,45.72
  Top 0.305: U3.9 29.75,54.13 30.48,53.41 v30.48,50.16
  Bottom 0.254: v63.5,45.72 38.73,45.72 34.29,50.16 v30.48,50.16
M8TXD  (via drill 0.56)  (1 unrouted)
  Top 0.305: RN4.8 67.2,44.45 v66.04,44.45 | v29.53,51.44 29.74,51.65 29.74,52.8 29.1,53.43 28.57,53.43
  Bottom 0.305: v66.04,44.45 62.87,47.62 38.1,47.62 34.29,51.44 v29.53,51.44
MICRO  (via drill 0.56)
  Top 0.305: ZU4.4 62.23,40.23 v64,42 | v71,42 73,44 78,44 80.56,46.55 MICRO_SWITCH.1
  Bottom 0.305: v64,42 v71,42
MISO2  (via drill 0.61)
  Top 0.305: ICSP1.1 v33.66,76.2 | U3.17 28.42,63.34 v30.48,65.41
  Bottom 0.305: v33.66,76.2 33.66,68.58 v30.48,65.41
MOSI2  (via drill 0.61)  (1 unrouted)
  Top 0.305: v28.57,70.48 ICSP1.4 | v30.48,60.33 30.48,58.45 29.84,57.81 29.12,57.81
  Bottom 0.305: v30.48,60.33 30.48,61.59 28.57,63.5 v28.57,70.48
N$1
  Top 0.508: R7.2 53.98,17.14 53.55,16.73 R6.1 54.4,16.73 55.88,15.24 55.88,13.34 56.47,12.74 IC2.2
N$2
  Top 0.508: R5.1 R4.2 55.46,11.01 55.92,11.47 IC2.3
N$3
  Top 0.254: RN4.6 67.31,46.2 67.31,46.83 RN4.5 67.31,46.99 67.31,48.26 66.36,49.21 66.36,50.16 ON.A
PWRIN
  Top 0.61: X1.2 D1.A
RD+
  Top 0.254: U3.29 22.95,55.63 21.59,56.99 21.59,59.69 20.39,60.89 RN3.4
RD-
  Top 0.254: U3.30 22.32,55.13 20.32,57.12 20.32,57.9 RN3.1
RED_M
  Top 0.254: IC1.13 67.15,67.79 82.71,67.79 83.82,66.67 MOTOR.3
RESET  (via drill 0.35, 0.61)
  Top 0.254: ZU4.1 D2.A 69.85,35.88 v68.26,35.88 | 37.47,42.55 37.47,39.85 | 37.47,39.85 37.47,38.73 RN1.4 | C5.2 38.89,55.98 38.89,42.55 RESET-EN.2 37.47,42.55 | 37.47,42.55 RESET-EN.1 | v39.37,40.64 38.58,39.85 37.47,39.85
  Bottom 0.254: v39.37,40.64 62.87,40.64 67.63,35.88 v68.26,35.88
RESET2
  Top 0.254: ICSP1.5 24.53,74.69 | 24.53,74.69 24.45,74.61 24.45,73.03 26.19,71.28 32.86,64.61 32.86,50.64 34.61,48.9 34.61,38.42 35.08,37.94 36.04,37.94 RN1.6 | 24.53,74.69 22.54,76.68 20.32,76.68 D3.A
  Top 0.305: U3.24 24.92,59.84 26.19,61.12 26.19,71.28
SCK2  (via drill 0.61)
  Top 0.305: U3.15 29.14,57.15 31.11,57.15 31.75,57.78 v31.75,59.05 | v34.92,78.11 29.21,78.11 28.57,77.47 ICSP1.3
  Bottom 0.305: v31.75,59.05 34.92,62.23 v34.92,78.11
SCL
  Top 0.508: ZU4.28 73.03,17.78 79.38,17.78 80.9,16.25 LCD.3
SDA
  Top 0.508: ZU4.27 73.66,14.61 78.11,14.61 78.36,14.35 LCD.2
STEP  (via drill 0.35)
  Top 0.254: ZU4.15 36.83,22.07 35.24,23.65 35.24,30.32 v56.2,51.28
  Bottom 0.254: v56.2,51.28 54.93,51.28 51.75,54.45 51.75,57.47 IC1.7
TP1
  Top 0.508: FLOWMETER.3 52.7,2.12 R4.1
TP2  (via drill 0.61)
  Top 0.508: R6.2 v53.34,13.34
  Bottom 0.508: v53.34,13.34 55.88,10.79 55.88,5.71 57.81,3.79 FLOWMETER.5
TP_VUCAP
  Top 0.254: U3.27 23.59,56.63 23.11,57.1 23.11,68.58 C8.1
UGND
  Top 0.305: C8.2 19.68,69.85 19.05,69.22 19.05,69.06 18.97,68.98 | 18.97,68.98 18.89,68.9 18.89,66.67 | 18.89,66.67 GROUND.2 | 11.67,72.31 7.78,68.42 7.78,66.83 9.05,65.56 X2.4 | 11.67,72.31 11.91,72.55 11.91,76.2 L1.1 | 11.67,72.31 14.92,69.06 18.89,69.06 18.97,68.98 | U3.28 23.25,56.13 22.23,57.15 22.23,64.14 21.59,64.77 19.68,64.77 18.89,65.56 18.89,66.67
USBVCC
  Top 0.305: U3.31 20.34,54.63 19.68,53.98 12.06,53.98 10.79,55.24 8.26,55.24 7.62,54.61 7.62,53.34
  Top 0.508: T1.1 7.76,53.2 | 7.76,53.2 6.58,52.02 F1.1 | 7.62,53.34 7.76,53.2
USHIELD  (via drill 0.56)
  Top 0.305: L1.2 9.68,76.2 9.68,74.61 7.78,72.71 6.35,72.71 X2.P$1 4.35,70.67 4.35,62.67 X2.P$2 | Z2.2 16.83,56.52 v16.83,60.64 16.83,63.5 Z1.2
  Bottom 0.305: v16.83,60.64 6.35,60.64 X2.P$2
VIN
  Top 0.61: D1.C 16.81,16.81 19,19 19,26 17.17,27.83 PC1.+ 14.32,27.65 14.32,38.68 13.21,39.79 U1.3
XT1
  Top 0.254: R1.1 25.72,48.26 | 25.72,48.26 25.72,42.39 25.4,42.07 Y1.2 | C9.1 24.77,48.26 | 24.77,48.26 25.72,48.26 | U3.1 24.92,50.95 24.13,50.16 24.13,48.9 24.77,48.26
XT2
  Top 0.254: C11.1 30.16,48.26 | 30.16,48.26 30.16,42.39 30.48,42.07 Y1.1 | 30.16,48.26 R1.2 28.83,49.91 28.57,50.16 26.67,50.16 25.42,51.41 U3.2
XTAL1
  Top 0.254: 49.21,32.38 49.21,33.5 49.37,33.66 49.21,33.81 49.21,34.92 Y2.3 | 49.21,32.38 49.53,32.38 50.32,31.59 50.32,30.48 49.53,29.69 ZU4.9 | 49.21,32.38 R2.1
XTAL2
  Top 0.254: 47.31,32.38 47.31,33.5 47.15,33.66 47.31,33.81 47.31,34.92 Y2.1 | 47.31,32.38 46.99,32.38 46.2,31.59 46.2,30.48 46.99,29.69 ZU4.10 | 47.31,32.38 R2.2
XUSB
  Top 0.508: F1.2 3.81,56.2 6.03,58.42 7.14,58.42 10.95,62.23 10.95,65.41 X2.1

### Text on the board
tNames: Gruppo8 | Arduino Uno | v17